# EAGLE design RGBLightControl (EAGLE 5.09)
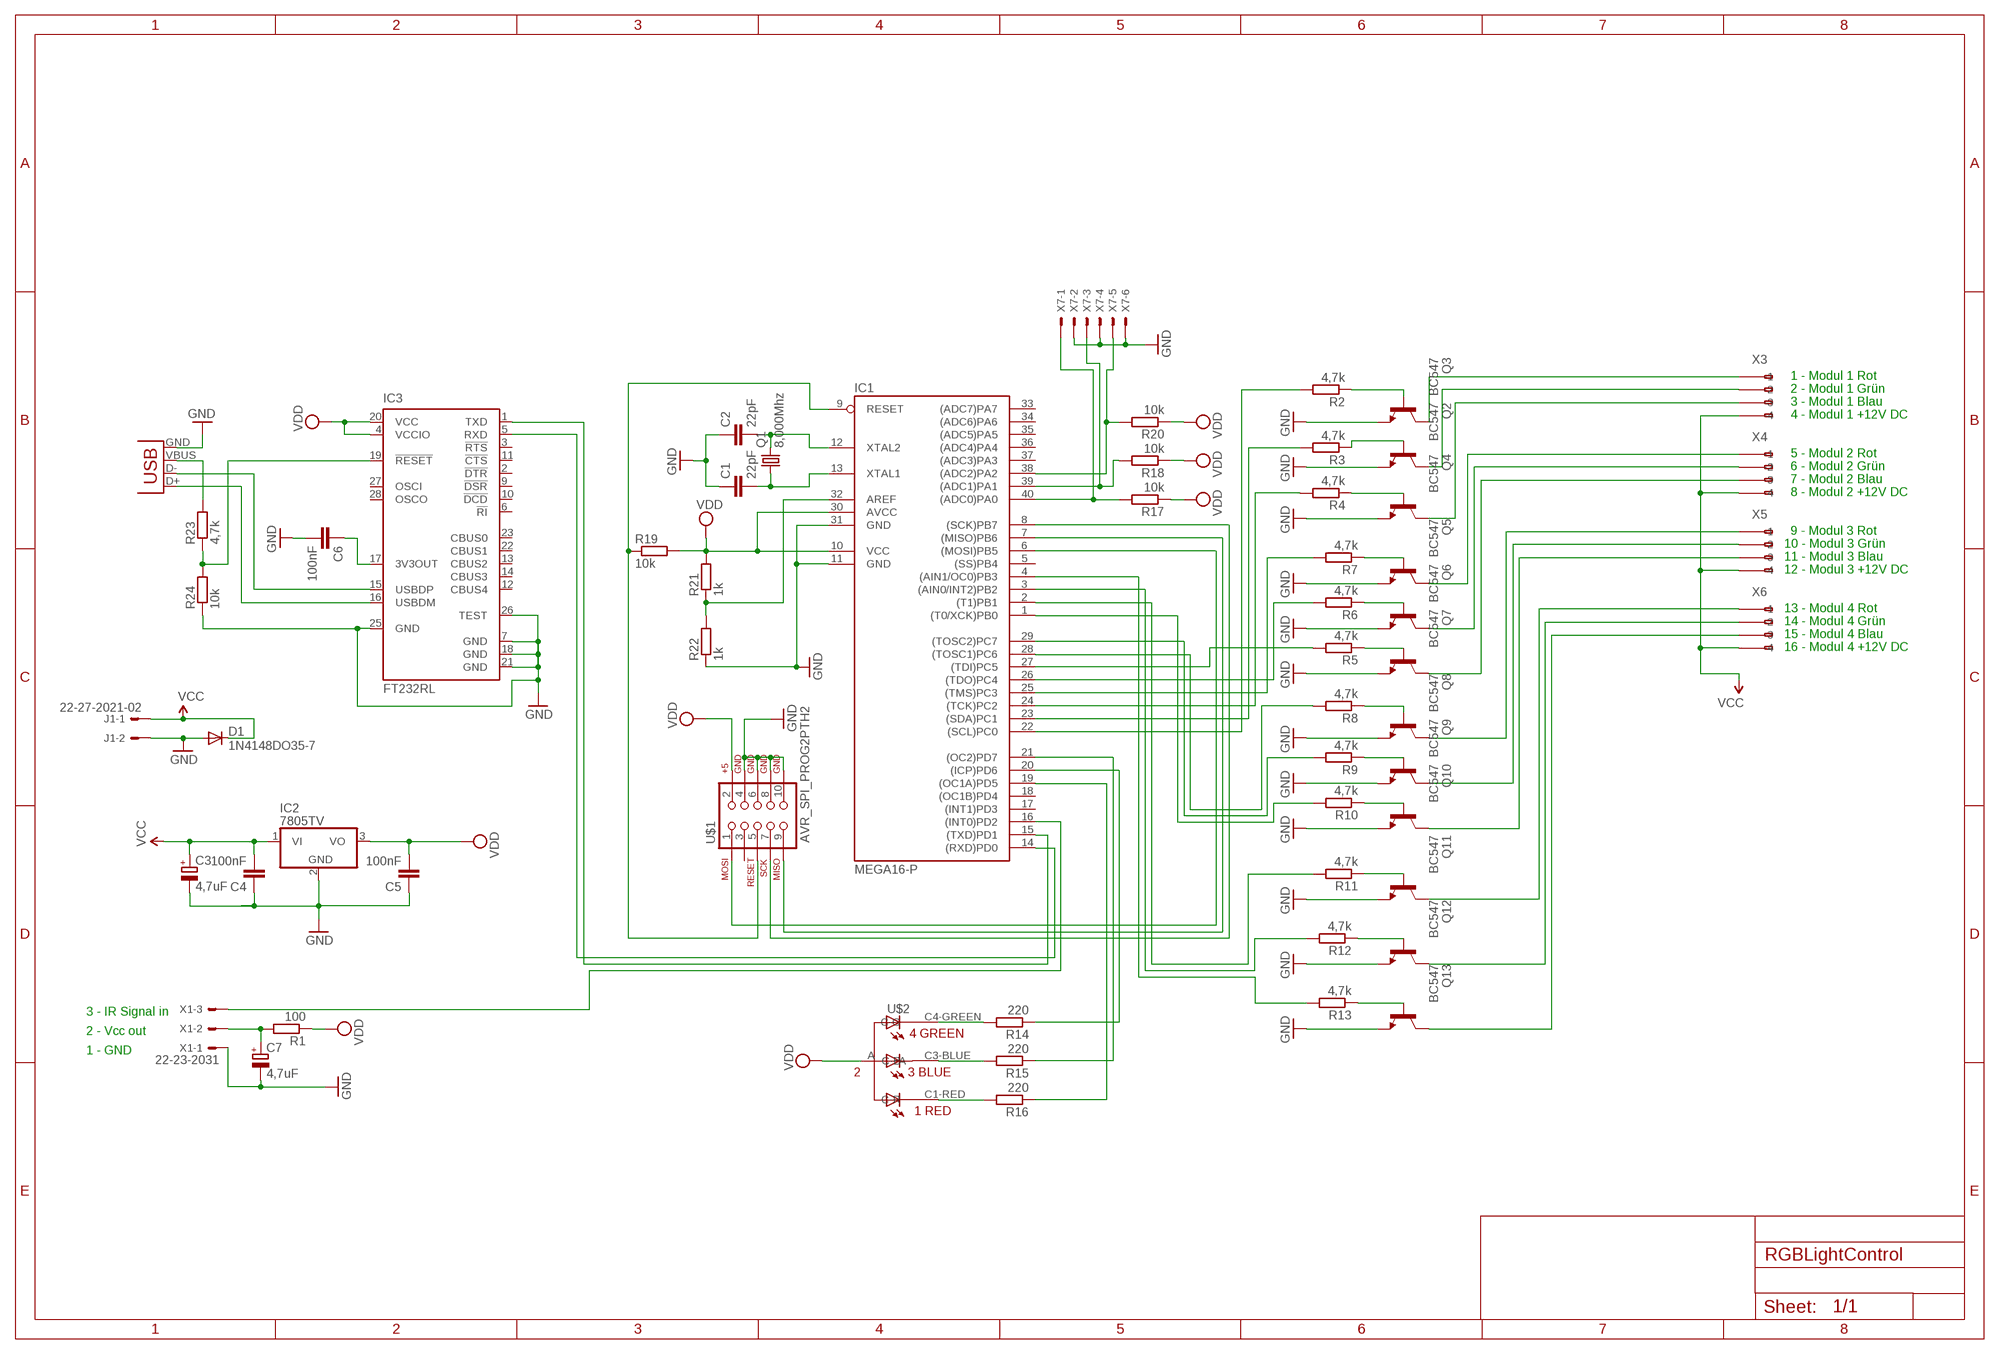
[diagram p0: schematic, sheet 1]

## Parts
C1  22pF  C-EUC1206K  [C1206K]
C2  22pF  C-EUC1206K  [C1206K]
C3  4,7uF  CPOL-EUE2.5-5  [E2,5-5]
C4  100nF  C-EUC1206K  [C1206K]
C5  100nF  C-EUC1206K  [C1206K]
C6  100nF  C-EUC1206K  [C1206K]
C7  4,7uF  CPOL-EUE2.5-5  [E2,5-5]
D1  1N4148DO35-7  [DO35-7]
IC1  MEGA16-P  [DIL40]
IC2  7805TV  [TO220V]
IC3  FT232RL  [SSOP28]
J1  22-27-2021-02  [6410-02]
Q1  8,000Mhz  CRYSTALHC49S  [HC49/S]
Q2  BC547  [TO92]
Q3  BC547  [TO92]
Q4  BC547  [TO92]
Q5  BC547  [TO92]
Q6  BC547  [TO92]
Q7  BC547  [TO92]
Q8  BC547  [TO92]
Q9  BC547  [TO92]
Q10  BC547  [TO92]
Q11  BC547  [TO92]
Q12  BC547  [TO92]
Q13  BC547  [TO92]
R1  100  R-EU_0204/7  [0204/7]
R2  4,7k  R-EU_0204/7  [0204/7]
R3  4,7k  R-EU_0204/7  [0204/7]
R4  4,7k  R-EU_0204/7  [0204/7]
R5  4,7k  R-EU_0204/7  [0204/7]
R6  4,7k  R-EU_0204/7  [0204/7]
R7  4,7k  R-EU_0204/7  [0204/7]
R8  4,7k  R-EU_0204/7  [0204/7]
R9  4,7k  R-EU_0204/7  [0204/7]
R10  4,7k  R-EU_0204/7  [0204/7]
R11  4,7k  R-EU_0204/7  [0204/7]
R12  4,7k  R-EU_0204/7  [0204/7]
R13  4,7k  R-EU_0204/7  [0204/7]
R14  220  R-EU_0204/7  [0204/7]
R15  220  R-EU_0204/7  [0204/7]
R16  220  R-EU_0204/7  [0204/7]
R17  10k  R-EU_M1206  [M1206]
R18  10k  R-EU_M1206  [M1206]
R19  10k  R-EU_M1206  [M1206]
R20  10k  R-EU_M1206  [M1206]
R21  1k  R-EU_M1206  [M1206]
R22  1k  R-EU_R1206  [R1206]
R23  4,7k  R-EU_0204/7  [0204/7]
R24  10k  R-EU_0204/7  [0204/7]
U$1  AVR_SPI_PROG2PTH2  [2X5-SHROUDED]
U$2  RGBLED_5MM_CA_4PIN  [RGBLED5MM_4PIN]
X1  22-23-2031  [22-23-2031]
X2  USB-MB-H  [USB-MB-H]
X3  233-504  [233-504]
X4  233-504  [233-504]
X5  233-504  [233-504]
X6  233-504  [233-504]
X7  22-23-2061  [22-23-2061]

## Nets
GND: C1.1 C2.1 C3.- C4.1 C5.1 C6.2 C7.- D1.A IC1.11(GND) IC1.31(GND) IC2.2(GND) IC3.7(GND) IC3.18(GND) IC3.21(GND) IC3.25(GND) IC3.26(TEST) J1.2 Q2.1(E) Q3.1(E) Q4.1(E) Q5.1(E) Q6.1(E) Q7.1(E) Q8.1(E) Q9.1(E) Q10.1(E) Q11.1(E) Q12.1(E) Q13.1(E) R22.1 R24.1 U$1.4 U$1.6 U$1.8 U$1.10 X1.1 X2.GND X7.2 X7.4 X7.6
N$1: Q3.3(C) X3.A1(-1)
N$2: Q11.3(C) X6.A1(-1)
N$3: Q2.3(C) X3.A2(-2)
N$4: Q12.3(C) X6.A2(-2)
N$5: Q4.3(C) X3.A3(-3)
N$6: Q13.3(C) X6.A3(-3)
N$7: R14.2 U$2.C4-GREEN(C-G)
N$8: IC1.22((SCL)PC0) R2.2
N$9: IC1.23((SDA)PC1) R3.2
N$10: IC1.24((TCK)PC2) R4.2
N$11: IC1.25((TMS)PC3) R7.2
N$12: Q7.3(C) X4.A3(-3)
N$13: Q5.3(C) X4.A1(-1)
N$14: Q6.3(C) X4.A2(-2)
N$15: Q8.3(C) X5.A1(-1)
N$16: IC1.26((TDO)PC4) R6.2
N$17: Q10.3(C) X5.A3(-3)
N$18: Q9.3(C) X5.A2(-2)
N$19: IC1.27((TDI)PC5) R5.2
N$20: IC1.28((TOSC1)PC6) R8.2
N$21: IC1.29((TOSC2)PC7) R9.2
N$22: IC1.1((T0/XCK)PB0) R10.2
N$23: IC1.2((T1)PB1) R11.2
N$24: IC1.3((AIN0/INT2)PB2) R12.2
N$25: IC1.4((AIN1/OC0)PB3) R13.2
N$26: C7.+ R1.2 X1.2
N$27: Q3.2(B) R2.1
N$28: IC3.15(USBDP) X2.D-
N$29: C1.2 IC1.13(XTAL1) Q1.1
N$30: IC1.39((ADC1)PA1) R18.2 X7.3
N$31: C2.2 IC1.12(XTAL2) Q1.2
N$32: IC1.8((SCK)PB7) U$1.7
N$33: IC1.7((MISO)PB6) U$1.9
N$34: IC1.6((MOSI)PB5) U$1.1
N$35: IC3.16(USBDM) X2.D+
N$36: IC1.9(RESET) R19.1 U$1.5
N$37: IC1.32(AREF) R21.1 R22.2
N$38: R23.2 X2.VBUS
N$39: IC1.14((RXD)PD0) IC3.5(RXD)
N$40: IC3.19(!RESET) R23.1 R24.2
N$41: Q4.2(B) R4.1
N$42: C6.1 IC3.17(3V3OUT)
N$43: IC1.16((INT0)PD2) X1.3
N$44: Q2.2(B) R3.1
N$45: IC1.15((TXD)PD1) IC3.1(TXD)
N$46: Q5.2(B) R7.1
N$47: Q6.2(B) R6.1
N$48: Q7.2(B) R5.1
N$49: Q8.2(B) R8.1
N$50: Q9.2(B) R9.1
N$51: Q10.2(B) R10.1
N$52: R15.2 U$2.C3-BLUE(C-B)
N$53: R16.2 U$2.C1-RED(C-R)
N$54: Q11.2(B) R11.1
N$55: Q12.2(B) R12.1
N$56: Q13.2(B) R13.1
N$57: IC1.20((ICP)PD6) R14.1
N$58: IC1.21((OC2)PD7) R15.1
N$59: IC1.19((OC1A)PD5) R16.1
N$60: IC1.40((ADC0)PA0) R17.2 X7.1
N$61: IC1.38((ADC2)PA2) R20.2 X7.5
VCC: C3.+ C4.2 D1.C IC2.1(VI) J1.1 X3.A4(-4) X4.A4(-4) X5.A4(-4) X6.A4(-4)
VDD: C5.2 IC1.10(VCC) IC1.30(AVCC) IC2.3(VO) IC3.4(VCCIO) IC3.20(VCC) R1.1 R17.1 R18.1 R19.2 R20.1 R21.2 U$1.2 U$2.A
Unconnected: IC1.5((SS)PB4) IC1.17((INT1)PD3) IC1.18((OC1B)PD4) IC1.33((ADC7)PA7) IC1.34((ADC6)PA6) IC1.35((ADC5)PA5) IC1.36((ADC4)PA4) IC1.37((ADC3)PA3) IC3.2(!DTR) IC3.3(!RTS) IC3.6(!RI) IC3.9(!DSR) IC3.10(!DCD) IC3.11(!CTS) IC3.12(CBUS4) IC3.13(CBUS2) IC3.14(CBUS3) IC3.22(CBUS1) IC3.23(CBUS0) IC3.27(OSCI) IC3.28(OSCO) U$1.3 X3.B1(B-1) X3.B2(B-2) X3.B3(B-3) X3.B4(B-4) X4.B1(B-1) X4.B2(B-2) X4.B3(B-3) X4.B4(B-4) X5.B1(B-1) X5.B2(B-2) X5.B3(B-3) X5.B4(B-4) X6.B1(B-1) X6.B2(B-2) X6.B3(B-3) X6.B4(B-4)

## Notes on the sheet
- 1 - Modul 1 Rot
- 2 - Modul 1 Grün
- 3 - Modul 1 Blau
- 4 - Modul 1 +12V DC
- 5 - Modul 2 Rot
- 6 - Modul 2 Grün
- 7 - Modul 2 Blau
- 8 - Modul 2 +12V DC
- 9 - Modul 3 Rot
- 10 - Modul 3 Grün
- 11 - Modul 3 Blau
- 12 - Modul 3 +12V DC
- 13 - Modul 4 Rot
- 14 - Modul 4 Grün
- 15 - Modul 4 Blau
- 16 - Modul 4 +12V DC
- 3 - IR Signal in
- 2 - Vcc out
- 1 - GND

## Library data of the parts
C1 C2 C4-C6 = resistor:C-EU: CAPACITOR, European symbol
C3 C7 = rcl:CPOL-EU: POLARIZED CAPACITOR, European symbol
D1 = diode:1N4148: DIODE high speed (Philips)
IC1 = atmel:MEGA16-P: MICROCONTROLLER 16 Kbytes FLASH 1 kbytes SRAM 512 bytes EEPROM USART 8-channel 10 bit ADC Source: avr.lbr
IC2 = linear:78*: Positive VOLTAGE REGULATOR Source: http://cache.national.com/ds/LM/LM78L05.pdf http://www.fairchildsemi.com/ds/LM/LM7805.pdf
IC3 = ftdichip:FT232R: Source: http://www.ftdichip.com/Documents/DataSheets/DS_FT232R_v104.pdf
J1 = con-molex:22-?-02: CONNECTOR wire to board 2.54 mm (.1 inch) pitch header
Q1 = crystal:CRYSTAL: CRYSTAL
Q2-Q13 = transistor-npn:BC547*: NPN Transistor
R1-R24 = resistor:R-EU_: RESISTOR, European symbol
U$1 = SparkFun:AVR_SPI_PROG2: AVR ICSP Header This is the standard AVR In Circuit Serial Programming header. Minimal, but includes pin one indicator. Works with standard Olimex programmers. Also look for the 6-pin reduced version. Spark Fun Electronics SKU: PRT-00778
U$2 = rgb_led:RGBLED_5MM_CA_4PIN: RGB LED 5MM Common Anode This RGB LED is a rare component with a common anode.
X1 = con-molex:22-23-2031: .100" (2.54mm) Center Header - 3 Pin
X2 = SparkFun:USB: USB Connectors USB-B-PTH is fully proven SKU : PRT-00139 USB-miniB is fully proven SKU : PRT-00587 USB-A-PCB is untested. USB-A-H is throughly reviewed, but untested. Spark Fun Electronics SKU : PRT-00437 USB-B-SMT is throughly reviewed, but untested. Needs silkscreen touching up. USB-A-S has not been used/tested USB-MB-H has not been used/tested
X3-X6 = con-wago:233-504: WAGO Cage Clamp
X7 = con-molex:22-23-2061: .100" (2.54mm) Center Header - 6 Pin

## Board
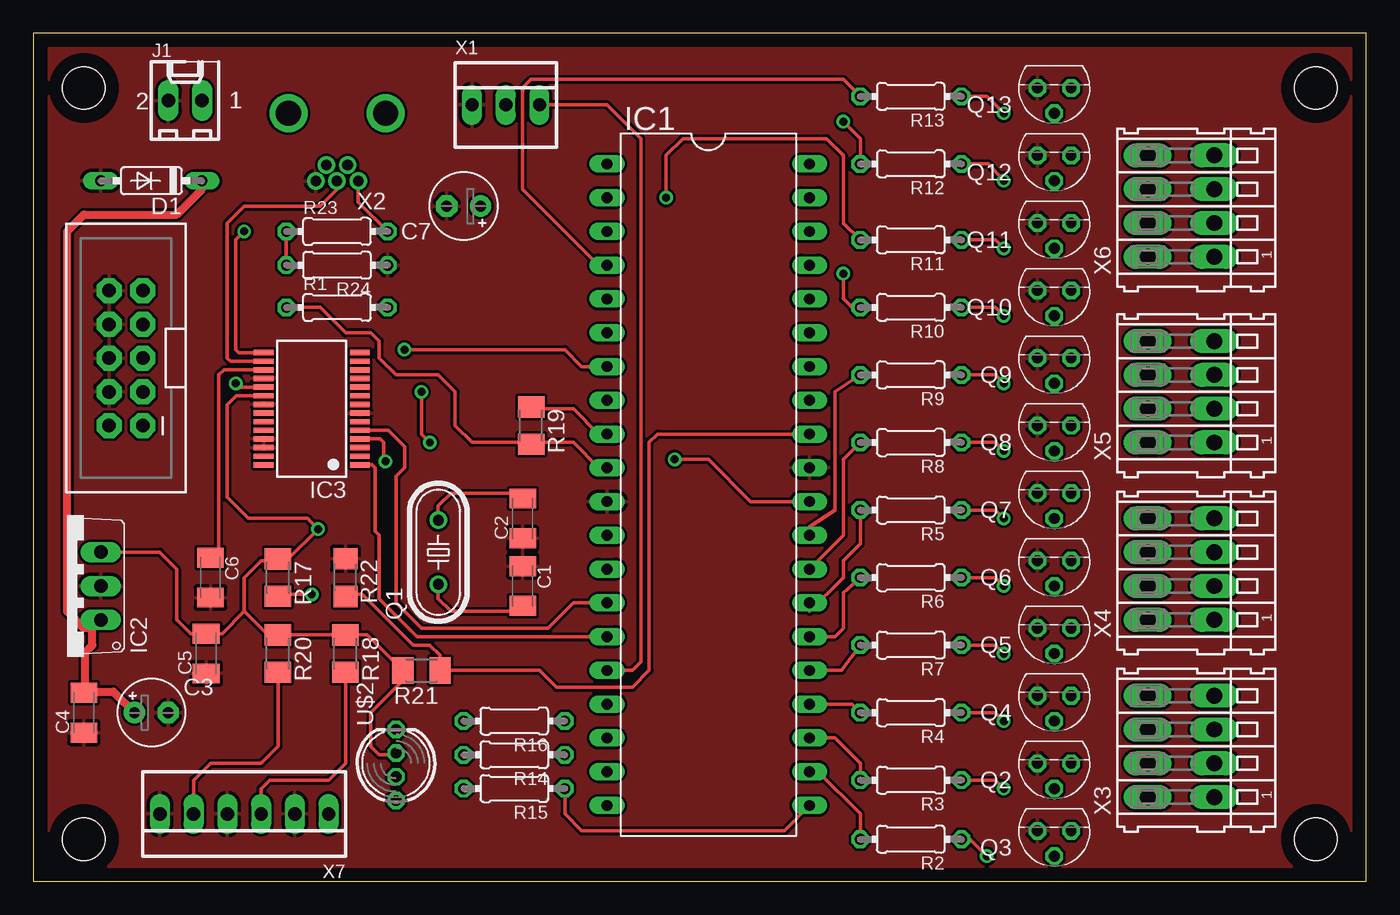
[diagram p1: board, top side]
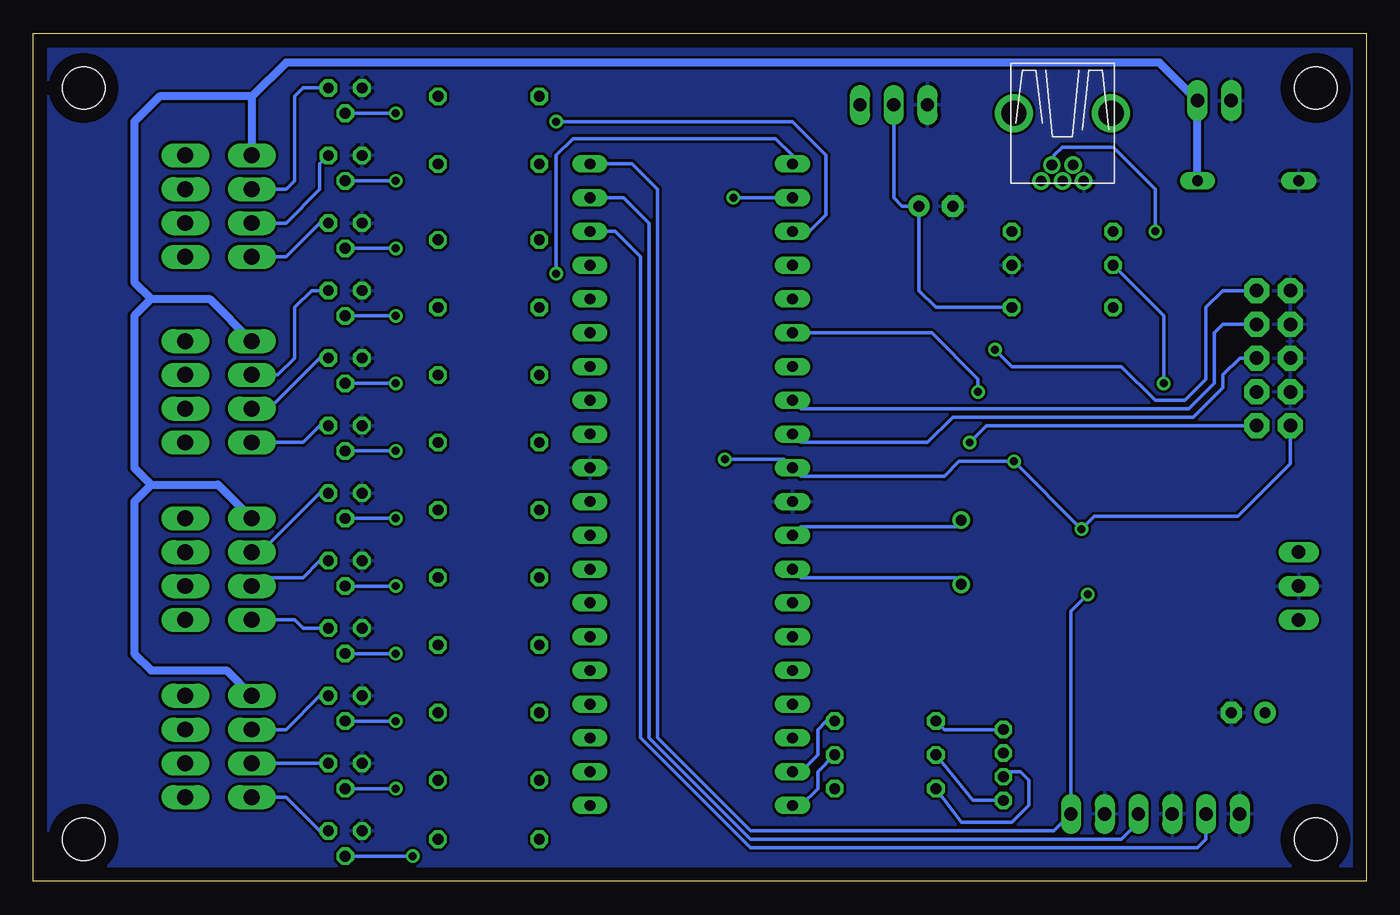
[diagram p2: board, bottom side, seen from below]

Size 100.31 x 63.8 mm. Coordinates in mm from the lower left corner, seen from the top.
Outline: 0,0 100.31,0 100.31,63.8 0,63.8 0,0
Copper layers (1*16): Top 0.035mm / dielectric 1.5mm / Bottom 0.035mm
Design rules "default": minimum track width 10mil, minimum drill 24mil, track to track 8mil, track to pad 8mil, pad to pad 8mil, via to via 8mil, smd to smd 8mil, copper to edge 40mil, drill to drill 8mil, minimum pad ring 10mil, minimum via ring 8mil, stop-mask expansion 4mil, vias tented up to drill 0mil, thermal gap 10mil
Holes 3.2 mm at 3.81,59.69 96.52,59.69 3.81,3.17 96.52,3.17

### Footprints (pad centres in the part's own frame; a part is rotated, then mirrored left to right if it is on the bottom)
C1206K = smd 1.5 x 2: 1 -1.5,0; 2 1.5,0
E2,5-5 = drill 0.813 pad 1.6 round: + -1.27,0 | drill 0.813 pad 1.6 octagon: - 1.27,0
DO35-7 = drill 0.813 long: A 3.81,0; C -3.81,0
DIL40 = drill 0.813 long: 1 -24.13,-7.62; 2 -21.59,-7.62; 3 -19.05,-7.62; 4 -16.51,-7.62; 5 -13.97,-7.62; 6 -11.43,-7.62; 7 -8.89,-7.62; 8 -6.35,-7.62; 9 -3.81,-7.62; 10 -1.27,-7.62; 11 1.27,-7.62; 12 3.81,-7.62; 13 6.35,-7.62; 14 8.89,-7.62; 15 11.43,-7.62; 16 13.97,-7.62; 17 16.51,-7.62; 18 19.05,-7.62; 19 21.59,-7.62; 20 24.13,-7.62; 21 24.13,7.62; 22 21.59,7.62; 23 19.05,7.62; 24 16.51,7.62; 25 13.97,7.62; 26 11.43,7.62; 27 8.89,7.62; 28 6.35,7.62; 29 3.81,7.62; 30 1.27,7.62; 31 -1.27,7.62; 32 -3.81,7.62; 33 -6.35,7.62; 34 -8.89,7.62; 35 -11.43,7.62; 36 -13.97,7.62; 37 -16.51,7.62; 38 -19.05,7.62; 39 -21.59,7.62; 40 -24.13,7.62
TO220V = drill 1.016 long: 1 -2.54,-2.54; 2 0,-2.54; 3 2.54,-2.54
SSOP28 = smd 0.4 x 1.5: 1 -4.225,-3.625; 2 -3.575,-3.625; 3 -2.925,-3.625; 4 -2.275,-3.625; 5 -1.625,-3.625; 6 -0.975,-3.625; 7 -0.325,-3.625; 8 0.325,-3.625; 9 0.975,-3.625; 10 1.625,-3.625; 11 2.275,-3.625; 12 2.925,-3.625; 13 3.575,-3.625; 14 4.225,-3.625; 15 4.225,3.625; 16 3.575,3.625; 17 2.925,3.625; 18 2.275,3.625; 19 1.625,3.625; 20 0.975,3.625; 21 0.325,3.625; 22 -0.325,3.625; 23 -0.975,3.625; 24 -1.625,3.625; 25 -2.275,3.625; 26 -2.925,3.625; 27 -3.575,3.625; 28 -4.225,3.625
6410-02 = drill 1.016 long: 1 1.27,0; 2 -1.27,0
HC49/S = drill 0.813 round: 1 -2.413,0; 2 2.413,0
TO92 = drill 0.813 octagon: 1 1.27,0; 2 0,1.905; 3 -1.27,0
0204/7 = drill 0.813 octagon: 1 -3.81,0; 2 3.81,0
M1206 = smd 1.6 x 2: 1 -1.4,0; 2 1.4,0
R1206 = smd 1.6 x 1.803: 1 -1.422,0; 2 1.422,0
2X5-SHROUDED = drill 1.016 pad 1.88 octagon: 1 -1.27,5.08; 2 1.27,5.08; 3 -1.27,2.54; 4 1.27,2.54; 5 -1.27,0; 6 1.27,0; 7 -1.27,-2.54; 8 1.27,-2.54; 9 -1.27,-5.08; 10 1.27,-5.08
RGBLED5MM_4PIN = drill 0.8 octagon: A 0.762,0; C1-RED 2.54,0; C3-BLUE -1.016,0; C4-GREEN -2.794,0
22-23-2031 = drill 1 long: 1 -2.54,0; 2 0,0; 3 2.54,0
USB-MB-H = drill 0.8 round: D+ 5.1,0; D- 3.9,0.8; GND 5.1,-1.6; ID 3.9,-0.8; VBUS 5.1,1.6 | drill 1.9 round: P$6 0,-3.65; P$7 0,3.65
233-504 = drill 1.2 long: A1 -3.81,2.5; A2 -1.27,2.5; A3 1.27,2.5; A4 3.81,2.5; B1 -3.81,-2.5; B2 -1.27,-2.5; B3 1.27,-2.5; B4 3.81,-2.5
22-23-2061 = drill 1 long: 1 -6.35,0; 2 -3.81,0; 3 -1.27,0; 4 1.27,0; 5 3.81,0; 6 6.35,0

### Placement (x,y rotation side)
C1  36.83,22.23 270 top
C2  36.83,27.3 90 top
C3  8.89,12.7 0 top
C4  3.81,12.7 90 top
C5  13.02,17.14 90 top
C6  13.34,22.86 270 top
C7  32.38,50.8 180 top
D1  8.89,52.7 180 top
IC1  50.8,29.84 270 top
IC2  2.54,22.23 90 top
IC3  20.95,35.56 90 top
J1  11.43,58.74 0 top
Q1  30.48,24.77 90 top
Q2  76.83,8.89 180 top
Q3  76.83,3.81 180 top
Q4  76.83,13.97 180 top
Q5  76.83,19.05 180 top
Q6  76.83,24.13 180 top
Q7  76.83,29.21 180 top
Q8  76.83,34.29 180 top
Q9  76.83,39.37 180 top
Q10  76.83,44.45 180 top
Q11  76.83,49.53 180 top
Q12  76.83,54.61 180 top
Q13  76.83,59.69 180 top
R1  22.86,43.18 0 top
R2  66.04,3.17 180 top
R3  66.04,7.62 180 top
R4  66.04,12.7 180 top
R5  66.04,27.94 180 top
R6  66.04,22.86 180 top
R7  66.04,17.78 180 top
R8  66.04,33.02 180 top
R9  66.04,38.1 180 top
R10  66.04,43.18 180 top
R11  66.04,48.26 180 top
R12  66.04,53.98 180 top
R13  66.04,59.05 180 top
R14  36.2,9.53 180 top
R15  36.2,6.99 180 top
R16  36.2,12.06 180 top
R17  18.41,22.86 270 top
R18  23.5,17.14 270 top
R19  37.47,34.29 270 top
R20  18.41,17.14 270 top
R21  29.21,15.88 180 top
R22  23.5,22.86 270 top
R23  22.86,48.9 0 top
R24  22.86,46.35 180 top
U$1  6.99,39.37 180 top
U$2  27.3,8.89 90 top
X1  35.56,58.42 0 top
X2  22.86,57.78 270 top
X3  86.36,10.16 90 top
X4  86.36,23.5 90 top
X5  86.36,36.83 90 top
X6  86.36,50.8 90 top
X7  15.88,5.08 180 top

### Tracks (layer width: path | path; a pad name or v marks a point on that pad's centre or on a via)
GND
  pour Bottom: 0.64,62.87 99.69,62.87 99.69,0.64 0.64,0.64
  pour Top: 0.64,62.87 99.69,62.87 99.69,0.64 0.64,0.64
N$1
  Bottom 0.254: Q3.3 78.74,3.81 81.28,6.35 X3.A1
N$2
  Bottom 0.254: Q11.3 78.74,49.53 81.28,46.99 X6.A1
N$3
  Bottom 0.254: Q2.3 X3.A2
N$4
  Bottom 0.254: Q12.3 78.74,53.98 78.74,52.07 81.28,49.53 X6.A2
N$5
  Bottom 0.254: Q4.3 78.74,13.97 81.28,11.43 X3.A3
N$6
  Bottom 0.254: Q13.3 78.74,59.69 80.01,59.69 80.64,59.05 80.64,52.7 81.28,52.07 81.92,52.07 X6.A3
N$7
  Bottom 0.254: U$2.C4-GREEN 29.59,6.1 R14.2
N$8
  Top 0.254: IC1.22 59.05,8.26 62.23,5.08 R2.2
N$9
  Top 0.254: R3.2 62.23,8.89 60.33,10.79 IC1.23
N$10
  Top 0.254: R4.2 61.59,13.34 IC1.24
N$11
  Top 0.254: IC1.25 60.83,15.88 R7.2
N$12
  Bottom 0.254: Q7.3 78.74,29.21 82.55,25.4 83.82,25.4 X4.A3
N$13
  Bottom 0.254: Q5.3 80.01,19.05 80.64,19.68 X4.A1
N$14
  Bottom 0.254: Q6.3 78.74,24.13 80.01,22.86 83.82,22.86 X4.A2
N$15
  Bottom 0.254: Q8.3 78.74,34.29 80.01,33.02 X5.A1
N$16
  Top 0.254: IC1.26 60.33,18.41 60.96,19.05 60.96,21.72 R6.2
N$17
  Bottom 0.254: Q10.3 79.38,44.45 80.64,43.18 80.64,39.37 81.92,38.1 X5.A3
N$18
  Bottom 0.254: Q9.3 78.74,39.37 82.55,35.56 X5.A2
N$19
  Top 0.254: IC1.27 58.42,20.32 60.96,22.86 60.96,24.13 62.23,25.4 R5.2
N$20
  Top 0.254: R8.2 60.96,31.75 60.96,26.04 IC1.28
N$21
  Top 0.254: R9.2 60.33,36.83 60.33,27.94 58.42,26.67 IC1.29
N$22  (via drill 0.61)
  Top 0.254: v60.96,45.72 60.96,43.81 61.59,43.18 R10.2
  Bottom 0.254: v60.96,45.72 60.96,54.61 59.69,55.88 44.45,55.88 43.18,54.61 IC1.1
N$23  (via drill 0.61)
  Top 0.254: v47.62,51.44 47.62,54.61 48.9,55.88 59.69,55.88 60.96,54.61 60.96,49.53 R11.2
  Bottom 0.254: IC1.2 v47.62,51.44
N$24  (via drill 0.61)
  Top 0.254: v60.96,57.15 62.23,55.88 R12.2
  Bottom 0.254: v60.96,57.15 43.18,57.15 40.64,54.61 40.64,50.16 41.91,48.9 IC1.3
N$25
  Top 0.254: R13.2 60.96,60.33 37.47,60.33 36.83,59.69 36.83,52.07 42.55,46.35 IC1.4
N$26
  Bottom 0.254: X1.2 35.56,51.44 34.92,50.8 C7.+ 33.66,44.45 32.38,43.18 R1.2
N$27  (via drill 0.6)
  Top 0.254: v71.75,1.91 70.48,3.17 R2.1
  Bottom 0.254: v71.75,1.91 Q3.2
N$28  (via drill 0.6)
  Top 0.254: IC3.15 15.46,39.78 15.24,40.01 15.24,48.26 v15.88,48.9
  Bottom 0.254: v15.88,48.9 15.88,52.07 19.05,55.24 22.86,55.24 23.5,54.61 23.5,54.05 X2.D-
N$29
  Top 0.254: C1.2 36.83,20.32 31.43,20.32 30.48,21.27 Q1.1 30.48,22.86
  Bottom 0.254: IC1.13 42.55,22.86 30.48,22.86 Q1.1
N$30
  Top 0.254: X7.3 17.14,6.99 17.78,7.62 22.23,7.62 23.5,8.89 R18.2
  Bottom 0.254: IC1.39 55.88,51.44 53.98,49.53 53.98,10.79 46.35,3.17 18.41,3.17 17.14,4.45 X7.3
N$31
  Top 0.254: C2.2 36.83,29.21 31.43,29.21 30.48,28.26 Q1.2 30.48,26.67
  Bottom 0.254: IC1.12 42.55,26.67 30.48,26.67 Q1.2
N$32
  Bottom 0.254: IC1.8 42.55,35.56 13.34,35.56 11.43,37.47 11.43,41.27 10.79,41.91 U$1.7
N$33  (via drill 0.61)
  Top 0.254: v27.94,40.01 40.01,40.01 41.27,38.73 IC1.7
  Bottom 0.254: v27.94,40.01 26.67,38.73 18.41,38.73 15.88,36.2 13.65,36.2 12.06,37.78 12.06,43.18 10.79,44.45 U$1.9
N$34  (via drill 0.6)
  Top 0.254: v29.21,36.83 29.21,33.66 v29.84,33.02
  Bottom 0.254: U$1.1 28.57,34.29 v29.84,33.02 | IC1.6 32.7,41.27 29.21,37.78 v29.21,36.83
N$35
  Top 0.254: IC3.16 14.84,39.13 14.61,39.37 14.61,49.53 15.88,50.8 21.59,50.8 22.86,52.07 X2.D+
N$36
  Top 0.254: IC1.9 42.55,33.66 40.64,35.56 37.59,35.56 R19.1
  Bottom 0.254: IC1.9 42.55,33.02 33.02,33.02 31.11,34.92 13.02,34.92 10.79,37.15 10.79,38.1 9.53,39.37 U$1.5
N$37
  Top 0.254: IC1.32 46.99,33.66 46.35,33.02 46.35,15.88 45.09,14.61 39.37,14.61 38.1,15.88 R21.1 30.61,17.02 29.84,17.78 28.57,17.78 24.77,21.59 23.65,21.59 R22.2
N$38
  Top 0.254: X2.VBUS 24.46,51.1 R23.2
N$39
  Top 0.254: IC3.5 26.71,33.94 27.94,32.7 27.94,31.11 27.3,30.48 27.3,20.95 29.21,19.05 38.73,19.05 40.64,20.95 IC1.14
N$40  (via drill 0.6)
  Top 0.254: R24.2 R23.1 | IC3.19 15.52,37.19 v15.24,37.47
  Bottom 0.254: v15.24,37.47 15.24,42.55 R24.2
N$41  (via drill 0.6)
  Top 0.254: v73.03,12.06 72.39,12.7 R4.1
  Bottom 0.254: v73.03,12.06 Q4.2
N$42
  Top 0.254: IC3.17 14.36,38.48 13.97,38.1 13.97,25 C6.1
N$43
  Top 0.254: X1.3 43.18,58.42 45.72,55.88 45.72,16.51 45.09,15.88 IC1.16
N$44  (via drill 0.6)
  Top 0.254: v73.03,6.99 72.39,7.62 R3.1
  Bottom 0.254: v73.03,6.99 Q2.2
N$45
  Top 0.254: IC3.1 25.5,31.34 25.72,31.11 25.72,26.35 26.04,26.04 26.04,21.27 28.89,18.41 IC1.15
N$46  (via drill 0.6)
  Top 0.254: v73.03,17.14 72.39,17.78 R7.1
  Bottom 0.254: v73.03,17.14 Q5.2
N$47  (via drill 0.6)
  Top 0.254: v73.03,22.23 72.39,22.86 R6.1
  Bottom 0.254: v73.03,22.23 Q6.2
N$48  (via drill 0.6)
  Top 0.254: v73.03,27.3 72.39,27.94 R5.1
  Bottom 0.254: v73.03,27.3 Q7.2
N$49  (via drill 0.6)
  Top 0.254: v73.03,32.38 72.39,33.02 R8.1
  Bottom 0.254: v73.03,32.38 Q8.2
N$50  (via drill 0.6)
  Top 0.254: v73.03,37.47 72.39,38.1 R9.1
  Bottom 0.254: v73.03,37.47 Q9.2
N$51  (via drill 0.6)
  Top 0.254: v73.03,42.55 72.39,43.18 R10.1
  Bottom 0.254: v73.03,42.55 Q10.2
N$52
  Bottom 0.254: R15.2 30.48,4.45 26.67,4.45 25.4,5.71 25.4,7.62 26.04,8.26 26.92,8.26 U$2.C3-BLUE
N$53
  Bottom 0.254: R16.2 31.75,11.43 U$2.C1-RED
N$54  (via drill 0.6)
  Top 0.254: v73.03,47.62 72.39,48.26 R11.1
  Bottom 0.254: v73.03,47.62 Q11.2
N$55  (via drill 0.6)
  Top 0.254: v73.03,52.7 71.89,53.98 R12.1
  Bottom 0.254: v73.03,52.7 Q12.2
N$56  (via drill 0.6)
  Top 0.254: v73.03,57.78 71.75,59.05 R13.1
  Bottom 0.254: v73.03,57.78 Q13.2
N$57
  Bottom 0.254: IC1.20 42.55,5.71 41.27,6.99 41.27,8.26 R14.1
N$58
  Top 0.254: R15.1 40.01,5.08 41.27,3.81 56.52,3.81 IC1.21
N$59
  Bottom 0.254: IC1.19 42.55,8.26 41.27,9.53 41.27,11.43 40.64,12.06 R16.1
N$60  (via drill 0.6)
  Top 0.254: v20.95,21.59 18.55,21.59 R17.2
  Bottom 0.254: IC1.40 55.24,53.98 53.34,52.07 53.34,10.79 46.35,3.81 23.5,3.81 X7.1 22.23,20.32 v20.95,21.59
N$61
  Top 0.254: X7.5 12.06,7.62 13.34,8.89 17.14,8.89 18.41,10.16 R20.2
  Bottom 0.254: IC1.38 56.52,48.9 54.61,46.99 54.61,10.79 46.35,2.54 12.7,2.54 12.06,3.17 X7.5
VCC
  Top 0.254: C4.2 3.9,14.29
  Top 0.61: D1.C 12.7,52.07 10.79,50.16 3.81,50.16 2.54,48.9 2.54,20.32 3.81,19.05 4.45,19.05 | 4.45,19.05 IC2.1 | 4.45,19.05 4.45,17.78 3.9,17.23 3.9,14.29 6.03,14.29 C3.+
  Bottom 0.406: 83.82,59.05 83.86,59.02
  Bottom 0.61: D1.C J1.1 15.56,61.59 81.28,61.59 83.82,59.05 90.81,59.05 92.71,57.15 92.71,45.09 91.44,43.81 | 83.86,59.02 X6.A4 | 91.44,43.81 87.03,43.81 X5.A4 | 91.44,43.81 92.71,42.55 92.71,31.11 91.44,29.84 | 91.44,29.84 86.4,29.84 X4.A4 | 91.44,29.84 92.71,28.57 92.71,17.14 91.44,15.88 85.77,15.88 X3.A4
VDD  (via drill 0.6, 0.61)
  Top 0.254: IC1.10 42.55,31.11 40.64,33.02 37.59,33.02 R19.2 37.34,33.02 33.02,33.02 31.75,34.29 31.75,36.83 30.48,38.1 27.3,38.1 26.04,39.37 26.04,40.64 25.4,41.27 23.5,41.27 21.59,43.18 R1.1 | v48.26,31.75 50.8,31.75 53.98,28.57 IC1.30 | IC3.20 15.26,36.53 14.61,35.88 14.61,28.89 16.19,27.3 20.64,27.3 20.95,26.99 | 20.95,26.99 | 20.95,26.99 v21.43,26.51 19.18,24.26 R17.1 18.29,24.13 17.14,24.13 15.88,22.86 15.88,20.32 | IC3.4 26.09,33.28 26.35,33.02 26.35,31.75 v26.51,31.59 | U$2.A 27.18,9.53 26.04,9.53 25.4,10.16 25.4,12.7 27.81,15.11 R21.2 25.14,18.55 R18.1 R20.1 17.65,18.55 15.88,20.32 | 15.88,20.32 14.2,18.64 C5.2 11.84,18.64 10.79,19.68 10.79,23.5 9.53,24.77 IC2.3
  Bottom 0.254: v48.26,31.75 43.81,31.75 IC1.10 42.55,30.48 31.75,30.48 30.64,31.59 v26.51,31.59 v21.43,26.51 20.48,27.46 9.68,27.46 5.71,31.43 U$1.2

### Text on the board
tDocu: M3-Vcc | M3-B | M3-G | M3-R | M3-Vcc | M3-B | M3-G | M3-R | M2-Vcc | M2-B | M2-G | M2-R | M1-Vcc | M1-B | M1-G | M1-R